# Altium schematic sheet US_AB_SC.SchDoc
size A4
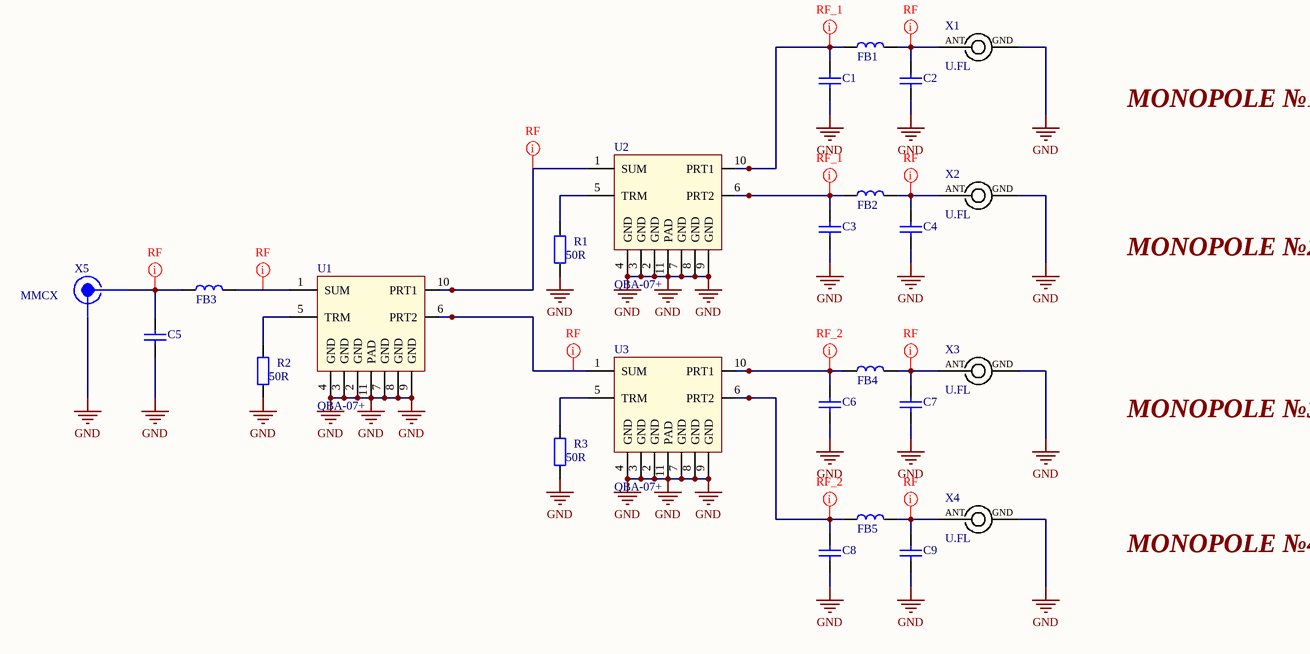
[diagram p0: US_AB_SC.SchDoc]

## Parts
C1  100n  [C0603_IPC_MD]  (value not drawn)
C2  100n  [C0603_IPC_MD]  (value not drawn)
C3  100n  [C0603_IPC_MD]  (value not drawn)
C4  100n  [C0603_IPC_MD]  (value not drawn)
C5  100n  [C0603_IPC_MD]  (value not drawn)
C6  100n  [C0603_IPC_MD]  (value not drawn)
C7  100n  [C0603_IPC_MD]  (value not drawn)
C8  100n  [C0603_IPC_MD]  (value not drawn)
C9  100n  [C0603_IPC_MD]  (value not drawn)
FB1  MH1608-601Y  [L0603_IPC_LD]  (value not drawn)  (no BOM)
FB2  MH1608-601Y  [L0603_IPC_LD]  (value not drawn)  (no BOM)
FB3  MH1608-601Y  [L0603_IPC_LD]  (value not drawn)  (no BOM)
FB4  MH1608-601Y  [L0603_IPC_LD]  (value not drawn)  (no BOM)
FB5  MH1608-601Y  [L0603_IPC_LD]  (value not drawn)  (no BOM)
R1  50R  [R0603_IPC_MD]  (no BOM)
R2  50R  [R0603_IPC_MD]  (no BOM)
R3  50R  [R0603_IPC_MD]  (no BOM)
U1  QBA-07+  [QBA-07+]
U2  QBA-07+  [QBA-07+]
U3  QBA-07+  [QBA-07+]
X1  U.FL  [U.FL]
X2  U.FL  [U.FL]
X3  U.FL  [U.FL]
X4  U.FL  [U.FL]
X5  MMCX  [MMCX_EDGE]

## Nets
GND: C1.1 C2.1 C3.1 C4.1 C5.1 C6.1 C7.1 C8.1 C9.1 R1.1 R2.1 R3.1 U1.2(GND) U1.3(GND) U1.4(GND) U1.7(GND) U1.8(GND) U1.9(GND) U1.11(PAD) U2.2(GND) U2.3(GND) U2.4(GND) U2.7(GND) U2.8(GND) U2.9(GND) U2.11(PAD) U3.2(GND) U3.3(GND) U3.4(GND) U3.7(GND) U3.8(GND) U3.9(GND) U3.11(PAD) X1.1 X2.1 X3.1 X4.1 X5.1
NetC1_2: C1.2 FB1.1 U2.10(PRT1)
NetC2_2: C2.2 FB1.2 X1.2
NetC3_2: C3.2 FB2.1 U2.6(PRT2)
NetC4_2: C4.2 FB2.2 X2.2
NetC5_2: C5.2 FB3.1 X5.2
NetC6_2: C6.2 FB4.1 U3.10(PRT1)
NetC7_2: C7.2 FB4.2 X3.2
NetC8_2: C8.2 FB5.1 U3.6(PRT2)
NetC9_2: C9.2 FB5.2 X4.2
NetFB3_2: FB3.2 U1.1(SUM)
NetR1_2: R1.2 U2.5(TRM)
NetR2_2: R2.2 U1.5(TRM)
NetR3_2: R3.2 U3.5(TRM)
NetU1_6: U1.6(PRT2) U3.1(SUM)
NetU1_10: U1.10(PRT1) U2.1(SUM)

## Layout directives
net class RF: NetC2_2, NetC4_2, NetC5_2, NetC7_2, NetC9_2, NetFB3_2, NetU1_6, NetU1_10
net class RF_2: NetC6_2, NetC8_2
net class RF_1: NetC1_2, NetC3_2

## Notes on the sheet
- MONOPOLE №1
- MONOPOLE №2
- MONOPOLE №3
- MONOPOLE №4
- (in symbol U.FL) ANT; GND

## Library data of the parts
C1-C9 = CL10B104KO8NNNC: Manufacturer: Samsung Electro-Mechanics; Voltage: 16V; Dielectric: X7R; Manufacturer Part Number: CL10B104KO8NNNC; Value: 100n; Supplier 1: Digi-Key; Supplier Part Number 1: 1276-1005-1-ND
FB1-FB5 = MH1608-601Y: FERRITE BEAD 600R@100MHz 0603 for Power Line, 1000mA; Manufacturer: Bourns Inc.; Manufacturer Part Number: MH1608-601Y; Supplier 1: Digi-Key; Supplier Part Number 1: MH1608-601YCT-ND
R1-R3 = CR0603-J/-000ELF: RES SMD 0 OHM JUMPER 1/10W 0603; Manufacturer: Bourns Inc.; Tolarance: 1%; Value: 50R; Manufacturer Part Number: CR0603-J/-000ELF; Supplier 1: Digi-Key; Supplier Part Number 1: CR0603-J/-000ELFCT-ND
U1-U3 = QBA-07+: Power Splitter/Combiner 2 Way-90° 50Ω 340 to 680 MHz; Manufacturer: Mini-Circuits®; Manufacturer Part Number: QBA-07+; Supplier 1: *****; Supplier Part Number 1: *****
X1-X4 = U.FL: SMA slot
X5 = MMCX: MMCX PCB EDGE CONN; Manufacturer: China; Manufacturer Part Number: MMCX; Supplier 1: Aliexpress; Supplier Part Number 1: MMCX